# EAGLE design sc-001 (EAGLE 9.6.2)
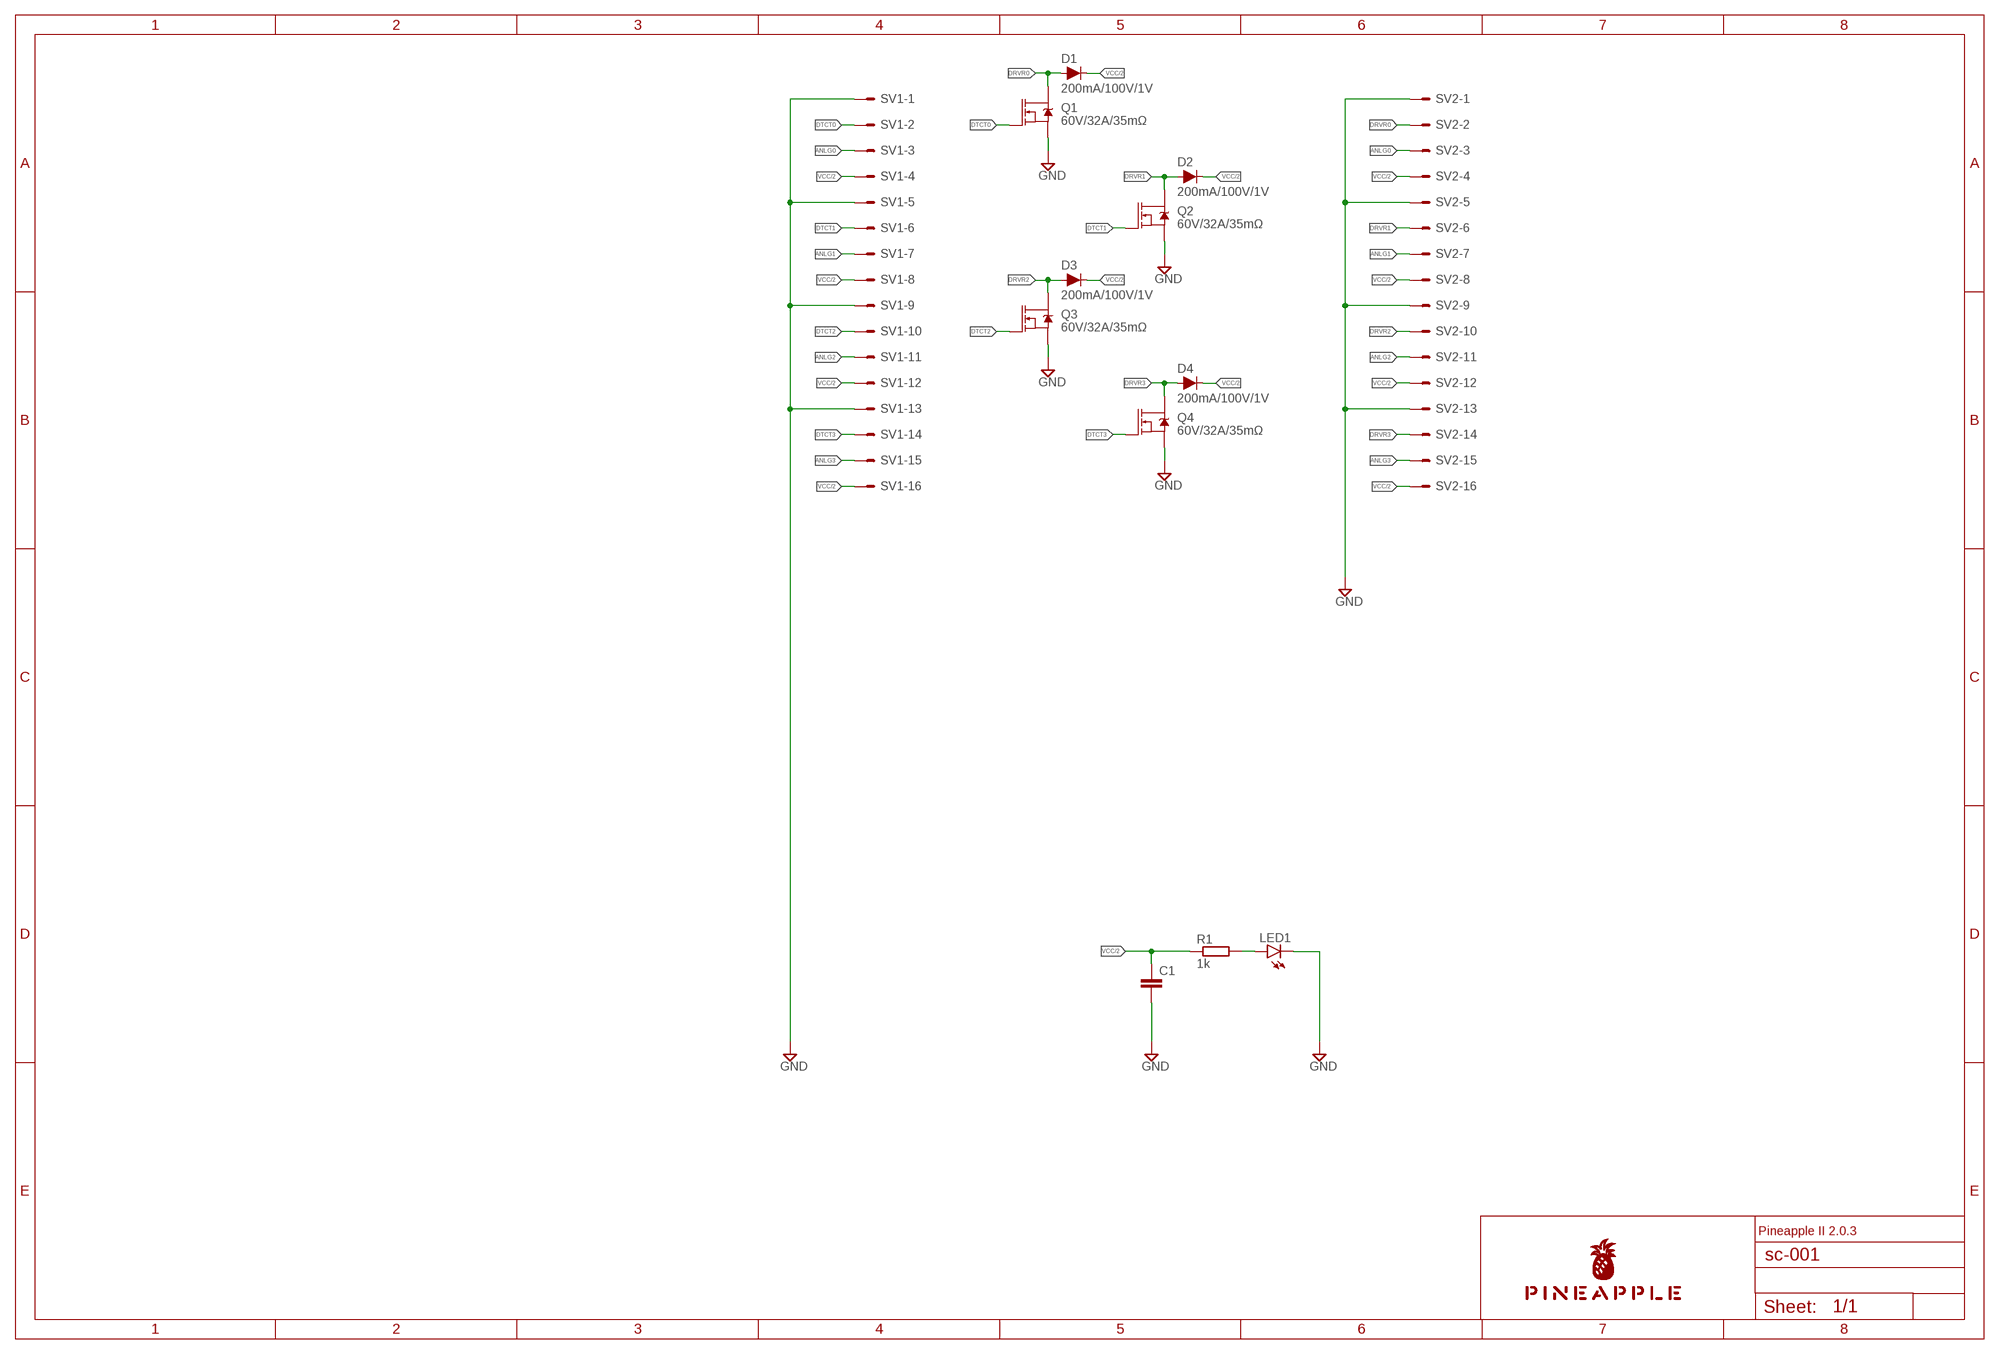
[diagram p0: schematic, sheet 1]

## Parts
C1  C-EU025-025X050  [C025-025X050]
D1  200mA/100V/1V  DIODE-1N4148  [DIODE-1N4148]
D2  200mA/100V/1V  DIODE-1N4148  [DIODE-1N4148]
D3  200mA/100V/1V  DIODE-1N4148  [DIODE-1N4148]
D4  200mA/100V/1V  DIODE-1N4148  [DIODE-1N4148]
LED1  LED3MM  [LED3MM]
Q1  60V/32A/35mΩ  MOSFET-NCH-FQP30N06L  [TO220V]
Q2  60V/32A/35mΩ  MOSFET-NCH-FQP30N06L  [TO220V]
Q3  60V/32A/35mΩ  MOSFET-NCH-FQP30N06L  [TO220V]
Q4  60V/32A/35mΩ  MOSFET-NCH-FQP30N06L  [TO220V]
R1  1k  R-EU_0204/5  [0204/5]
SV1  ML16LE  [ML16L]
SV2  ML16LE  [ML16L]
U$1  PINEAPPLE450_SILK  [PINEAPPLE450_SILK]

## Nets
ANLG0 [analog]: SV1.3 SV2.3
ANLG1 [analog]: SV1.7 SV2.7
ANLG2 [analog]: SV1.11 SV2.11
ANLG3 [analog]: SV1.15 SV2.15
DRVR0 [power]: D1.A Q1.2(D) SV2.2
DRVR1 [power]: D2.A Q2.2(D) SV2.6
DRVR2 [power]: D3.A Q3.2(D) SV2.10
DRVR3 [power]: D4.A Q4.2(D) SV2.14
DTCT0: Q1.1(G) SV1.2
DTCT1: Q2.1(G) SV1.6
DTCT2: Q3.1(G) SV1.10
DTCT3: Q4.1(G) SV1.14
GND [gnd]: C1.2 LED1.K(C) Q1.3(S) Q2.3(S) Q3.3(S) Q4.3(S) SV1.1 SV1.5 SV1.9 SV1.13 SV2.1 SV2.5 SV2.9 SV2.13
VCC2LED: LED1.A R1.2
VCC/2 [power]: C1.1 D1.C D2.C D3.C D4.C R1.1 SV1.4 SV1.8 SV1.12 SV1.16 SV2.4 SV2.8 SV2.12 SV2.16

## Notes on the sheet
- Pineapple II 2.0.3

## Library data of the parts
C1 = rcl:C-EU: CAPACITOR, European symbol; SPICEPREFIX: C
D1-D4 = SparkFun-DiscreteSemi:DIODE: Diode These are standard reverse protection diodes and small signal diodes. SparkFun Products: SparkFun SparkPunk Sound Kit <https://www.sparkfun.com/products/11177> SparkFun ESP8266 Thing <https://www.sparkfun.com/products/13231>; PROD_ID: DIO-08378
LED1 = led:LED: LED OSRAM: - CHIPLED LG R971, LG N971, LY N971, LG Q971, LY Q971, LO R971, LY R971 LH N974, LH R974 LS Q976, LO Q976, LY Q976 LO Q996 - Hyper CHIPLED LW Q18S LB Q993, LB Q99A, LB R99A - SideLED LS A670, LO A670, LY A670, LG A670, LP A670 LB A673, LV A673, LT A673, LW A673 LH A674 LY A675 LS A676, LA A676, LO A676, LY A676, LW A676 LS A679, LY A679, LG A679 - Hyper Micro SIDELED® LS Y876, LA Y876, LO Y876, LY Y876 LT Y87S - SmartLED LW L88C, LW L88S LB L89C, LB L89S, LG L890 LS L89K, LO L89K, LY L89K LS L896, LA L896, LO L896, LY L896 - TOPLED LS T670, LO T670, LY T670, LG T670, LP T670 LSG T670, LSP T670, LSY T670, LOP T670, LYG T670 LG T671, LOG T671, LSG T671 LB T673, LV T673, LT T673, LW T673 LH T674 LS T676, LA T676, LO T676, LY T676, LB T676, LH T676, LSB T676, LW T676 LB T67C, LV T67C, LT T67C, LS T67K, LO T67K, LY T67K, LW E67C LS E67B, LA E67B, LO E67B, LY E67B, LB E67C, LV E67C, LT E67C LW T67C LS T679, LY T679, LG T679 LS T770, LO T770, LY T770, LG T770, LP T770 LB T773, LV T773, LT T773, LW T773 LH T774 LS E675, LA E675, LY E675, LS T675 LS T776, LA T776, LO T776, LY T776, LB T776 LHGB T686 LT T68C, LB T68C - Hyper Mini TOPLED® LB M676 - Mini TOPLED Santana® LG M470 LS M47K, LO M47K, LY M47K Source: http://www.osram.convergy.de LUXEON: - LUMILED® LXK2-PW12-R00, LXK2-PW12-S00, LXK2-PW14-U00, LXK2-PW14-V00 LXK2-PM12-R00, LXK2-PM12-S00, LXK2-PM14-U00 LXK2-PE12-Q00, LXK2-PE12-R00, LXK2-PE12-S00, LXK2-PE14-T00, LXK2-PE14-U00 LXK2-PB12-K00, LXK2-PB12-L00, LXK2-PB12-M00, LXK2-PB14-N00, LXK2-PB14-P00, LXK2-PB14-Q00 LXK2-PR12-L00, LXK2-PR12-M00, LXK2-PR14-Q00, LXK2-PR14-R00 LXK2-PD12-Q00, LXK2-PD12-R00, LXK2-PD12-S00 LXK2-PH12-R00, LXK2-PH12-S00 LXK2-PL12-P00, LXK2-PL12-Q00, LXK2-PL12-R00 Source: www.luxeon.com KINGBRIGHT: KA-3528ASYC Source: www.kingbright.com
Q1-Q4 = SparkFun-DiscreteSemi:MOSFET-NCH: N-channel MOSFETs Voltage controlled devices that allow control of high current outputs. SparkFun Products: SparkFun OpenScale <https://www.sparkfun.com/products/13261> SparkFun Digital Sandbox <https://www.sparkfun.com/products/12651> SparkFun Monster Moto Shield <https://www.sparkfun.com/products/10182> SparkFun MOSFET Power Controller <https://www.sparkfun.com/products/11214>; PROD_ID: TRANS-10060
R1 = rcl:R-EU_: RESISTOR, European symbol; SPICEPREFIX: R
SV1 SV2 = con-ml:ML16LE: HARTING; OC_FARNELL: unknown; OC_NEWARK: unknown
U$1 = pineapple:PINEAPPLE450_SILK

## Net classes
0 default: width 0.152 mm, drill 0.152 mm, clearance 0.152 mm
1 gnd: width 0.305 mm, drill 0.152 mm, clearance 0.152 mm
2 power: width 0.508 mm, drill 0.152 mm, clearance 0.152 mm
3 analog: width 0.305 mm, drill 0.152 mm, clearance 0.152 mm
4 superpower: width 1.016 mm, drill 0.152 mm, clearance 0.152 mm

## Board
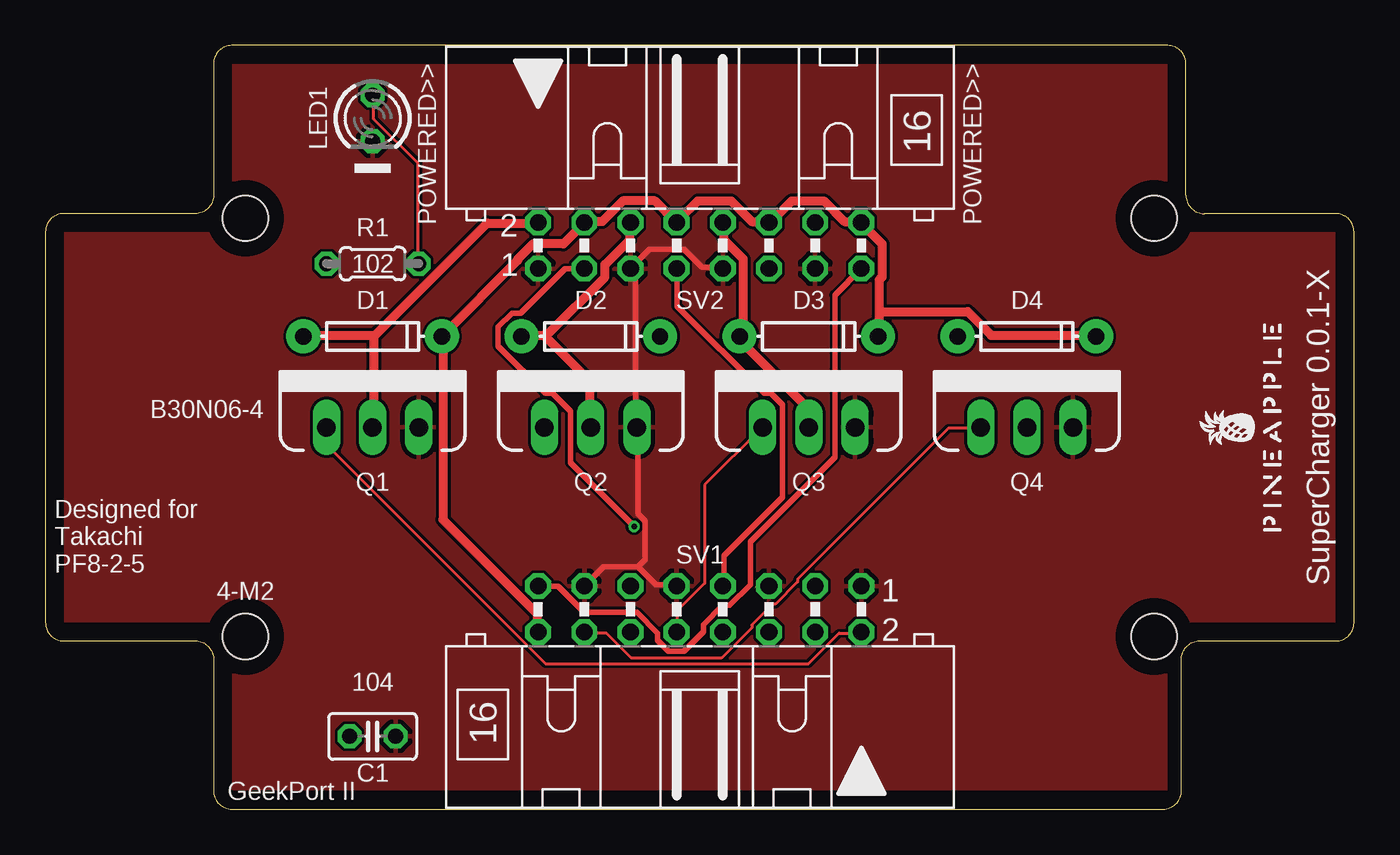
[diagram p1: board, top side]
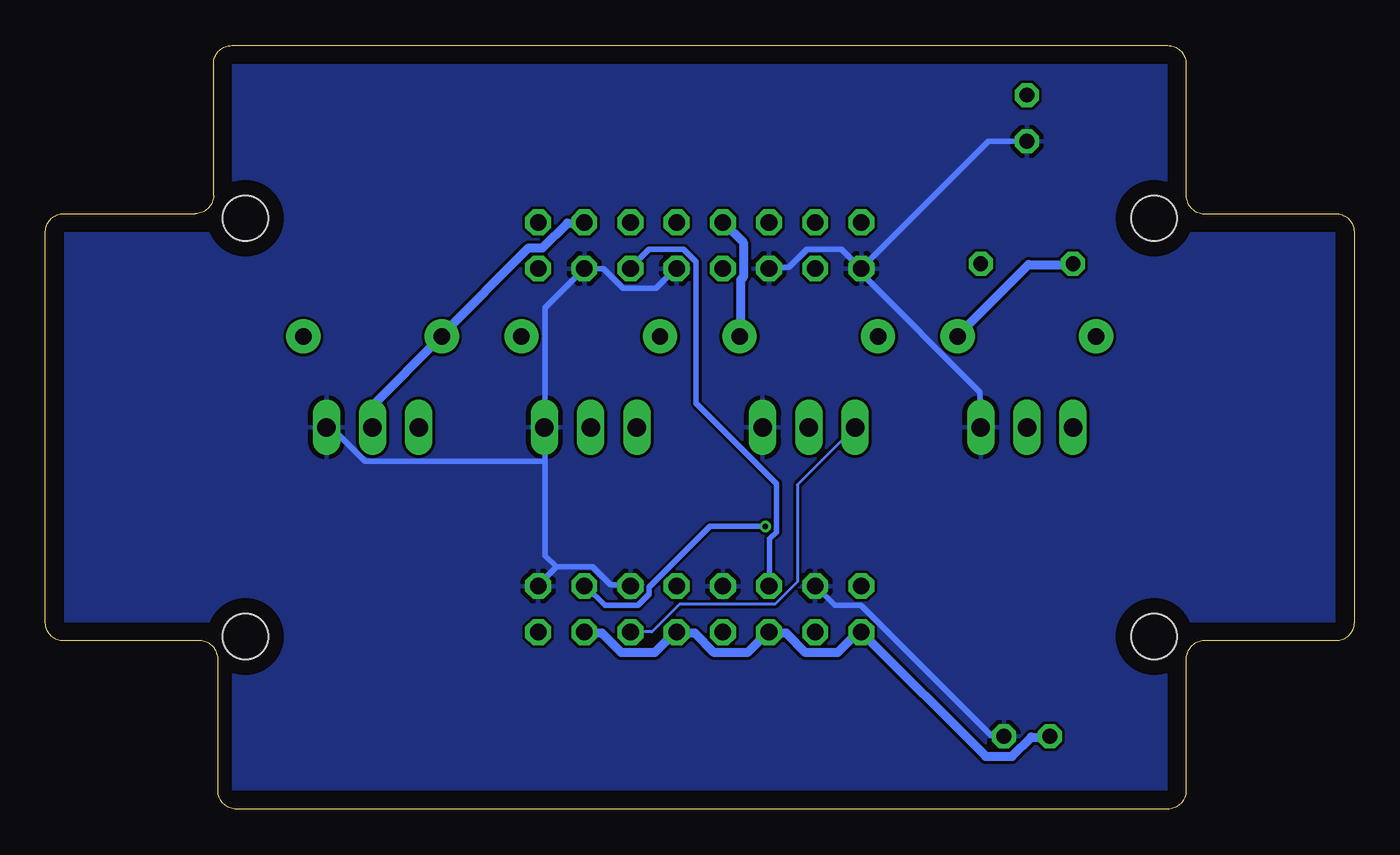
[diagram p2: board, bottom side, seen from below]

Size 72 x 42 mm. Coordinates in mm from the lower left corner, seen from the top.
Outline: 61.75,42 10.25,42 arc90 9.25,41 9.25,33.75 arc-90 8.25,32.75 1,32.75 arc90 0,31.75 0,10.25 arc90 1,9.25 8.25,9.25 arc-90 9.25,8.25 9.25,1 arc90 10.25,0 61.5,0 arc90 62.5,1 62.5,8.25 arc-90 63.5,9.25 71,9.25 arc90 72,10.25 72,31.75 arc90 71,32.75 63.75,32.75 arc-90 62.75,33.75 62.75,41 arc90 61.75,42
Copper layers (1*16): Top 0.035mm / dielectric 1.5mm / Bottom 0.035mm
Design rules "SeeedStudio_2layer_DRU_no_angle_20140221": minimum track width 6mil, minimum drill 12mil, track to track 6mil, track to pad 6mil, pad to pad 6mil, via to via 6mil, smd to smd 0mil, copper to edge 10mil, drill to drill 10mil, minimum pad ring 10mil, minimum via ring 6mil, stop-mask expansion 2mil, vias tented up to drill 100mil, thermal gap 10mil
Holes 2.5 mm at 61,32.5 11,32.5 11,9.5 61,9.5
tRestrict: area 9,30.5 to 13,34.5; area 59,30.5 to 63,34.5; area 9,7.5 to 13,11.5; area 59,7.5 to 63,11.5; area 0,41 to 72,42; area 71,0 to 72,42; area 0,0 to 72,1; area 0,0 to 1,42; area 0,31.8 to 9.2,32.8; area 9.2,32.8 to 10.2,42; area 61.8,32.8 to 62.8,42; area 62.8,31.8 to 72,32.8; 4 more areas
bRestrict: area 9,7.5 to 13,11.5; area 59,7.5 to 63,11.5; area 59,30.5 to 63,34.5; area 9,30.5 to 13,34.5; area 61.8,0 to 62.8,9.2; area 62.8,9.2 to 72,10.2; area 71,0 to 72,42; area 62.8,31.8 to 72,32.8; area 61.8,32.8 to 62.8,42; area 0,41 to 72,42; area 9.2,32.8 to 10.2,42; area 0,31.8 to 9.2,32.8; 4 more areas

### Footprints (pad centres in the part's own frame; a part is rotated, then mirrored left to right if it is on the bottom)
C025-025X050 = drill 0.813 octagon: 1 -1.27,0; 2 1.27,0
DIODE-1N4148 = drill 0.9 pad 1.88: A -3.81,0; C 3.81,0
LED3MM = drill 0.813 octagon: A -1.27,0; K 1.27,0
TO220V = drill 1.016 long: 1 -2.54,0; 2 0,0; 3 2.54,0
0204/5 = drill 0.813 octagon: 1 -2.54,0; 2 2.54,0
ML16L = drill 0.914 octagon: 1 -8.89,-1.27; 2 -8.89,1.27; 3 -6.35,-1.27; 4 -6.35,1.27; 5 -3.81,-1.27; 6 -3.81,1.27; 7 -1.27,-1.27; 8 -1.27,1.27; 9 1.27,-1.27; 10 1.27,1.27; 11 3.81,-1.27; 12 3.81,1.27; 13 6.35,-1.27; 14 6.35,1.27; 15 8.89,-1.27; 16 8.89,1.27

### Placement (x,y rotation side)
C1  18,4 0 top
D1  18,26 0 top
D2  30,26 0 top
D3  42,26 0 top
D4  54,26 0 top
LED1  18,38 270 top
Q1  18,21 0 top
Q2  30,21 0 top
Q3  42,21 0 top
Q4  54,21 0 top
R1  18,30 0 top
SV1  36,11 180 top
SV2  36,31 0 top
U$1  68,21 90 top

### Tracks (layer width: path | path; a pad name or v marks a point on that pad's centre or on a via)
ANLG0  (via drill 0.3)
  Top 0.305: v32.38,15.54 28.88,19.05 28.88,21.87 27.89,22.86 27.51,22.86 24.92,25.45 24.92,26.52 25.68,27.28 26.14,27.28 28.57,29.72 29.64,29.72 SV2.3
  Bottom 0.305: v32.38,15.54 35.43,15.54 38.79,12.19 38.79,11.81 39.4,11.2 41.22,11.2 42.29,12.27 SV1.3
ANLG1
  Top 0.305: SV2.7 34.75,29.72 34.75,27.66 39.55,22.86 39.93,22.86 40.54,22.25 40.54,17.14 37.34,13.95 37.34,12.34 SV1.7
ANLG2
  Bottom 0.305: SV1.11 32.16,12.34 32.16,14.86 31.77,15.24 31.77,17.91 36.2,22.33 36.2,30.1 36.88,30.79 38.79,30.79 39.78,29.79 SV2.11
ANLG3
  Top 0.305: SV1.15 27.13,12.27 28.19,12.27 29.64,10.82 32.54,10.82 33.68,9.68 33.68,9.3 34.29,8.69 35.13,8.69 36.2,9.75 36.2,10.13 37.26,11.2 37.64,11.2 38.79,12.34 38.79,14.71 43.43,19.36 43.43,28.27 44.88,29.72 SV2.15
DRVR0
  Top 0.508: 18.14,26.06 24.31,32.23 27.05,32.23 SV2.2 | 18.14,26.06 14.25,26.06 D1.A | Q1.2 18.06,21.03 18.06,25.83 18.14,26.06
DRVR1
  Top 0.508: 27.58,26.06 30.79,29.26 30.79,29.95 32.16,31.32 32.16,32.23 SV2.6 | 27.58,26.06 26.21,26.06 D2.A | Q2.2 29.95,21.03 29.95,23.55 27.66,25.83 27.58,26.06
DRVR2
  Top 0.508: SV2.10 37.34,32.23 37.34,31.32 38.41,30.25 38.41,26.21 38.25,26.06 D3.A 38.25,25.76 41.99,22.02 41.99,21.03 Q3.2
DRVR3
  Bottom 0.508: SV2.14 42.37,32.23 43.28,32.23 44.65,30.86 45.41,30.86 50.22,26.06 D4.A 50.37,25.83 53.95,22.25 53.95,21.03 Q4.2
DTCT0
  Top 0.152: SV1.2 44.88,9.68 43.66,9.68 41.99,8 27.51,8 15.47,20.04 15.47,20.95 Q1.1
DTCT1
  Bottom 0.152: SV1.6 39.78,9.75 38.63,9.75 37.11,11.28 31.85,11.28 30.63,12.5 30.63,17.83 27.51,20.95 Q2.1
DTCT2
  Top 0.152: SV1.10 34.75,9.75 34.75,10.9 36.27,12.42 36.27,17.83 39.4,20.95 Q3.1
DTCT3
  Top 0.152: SV1.14 29.72,9.68 30.86,9.68 32.23,8.31 37.19,8.31 38.86,9.98 38.86,10.13 40.01,11.28 40.16,11.28 41.38,12.5 41.38,12.65 49.68,20.95 51.44,20.95 Q4.1
GND
  Top 0.305: 32.61,13.34 33.6,12.34 34.67,12.34 SV1.9 | 32.61,13.34 30.71,13.34 29.72,12.34 SV1.13 | 32.61,13.34 32.99,13.72 32.99,15.85 32.61,16.23 32.61,20.95 Q2.3 32.46,21.11 32.46,29.49 32.31,29.64 SV2.5 32.23,29.79 33.22,30.79 35.13,30.79 36.12,29.79 37.26,29.79 SV2.9
  Bottom 0.305: C1.2 19.28,4.04 19.96,4.04 27.13,11.2 28.57,11.2 SV1.13 | 43.89,13.34 41.91,13.34 40.92,12.34 39.85,12.34 SV1.5 | 43.89,13.34 44.88,12.34 SV1.1 | 44.5,19.13 44.5,13.95 43.89,13.34 | 44.5,19.13 44.5,20.95 Q3.3 44.5,21.11 44.5,27.58 42.44,29.64 SV2.13 42.29,29.72 41.3,29.72 40.23,28.65 38.41,28.65 37.34,29.72 SV2.9 | 44.5,19.13 54.41,19.13 56.24,20.95 56.46,20.95 Q4.3 | LED1.K 18.06,36.73 20.12,36.73 27.05,29.79 SV2.1 | SV2.5 32.16,29.79 31.09,29.79 30.1,30.79 28.19,30.79 27.2,29.79 SV2.1 | Q1.3 20.57,21.03 20.57,22.94 27.05,29.41 27.05,29.64 SV2.1
  pour Top: -1,-1 73,-1 73,43 -1,43
  pour Bottom: -2,-2 74,-2 74,44 -2,44
VCC2LED
  Top 0.152: LED1.A 18.06,39.24 18.06,37.95 20.5,35.51 20.5,30.02 R1.2
VCC/2
  Top 0.508: 45.87,27.36 45.87,29.11 46.02,29.26 46.02,31.09 45.03,32.08 SV2.16 44.88,32.31 43.97,32.31 42.82,33.45 41.07,33.45 40.01,32.38 SV2.12 39.78,32.31 38.86,32.31 37.72,33.45 35.89,33.45 34.9,32.46 SV2.8 34.67,32.31 33.53,33.45 31.77,33.45 30.63,32.31 29.72,32.31 SV2.4 29.49,32.08 28.5,31.09 26.82,31.09 25.98,30.25 25.98,30.18 21.87,26.06 D1.C 21.87,25.76 21.87,15.93 27.05,10.74 27.05,9.75 SV1.16 | 45.87,27.36 45.87,26.06 D3.C | 45.87,27.36 50.75,27.36 52.05,26.06 57.76,26.06 D4.C
  Bottom 0.508: C1.1 16.76,3.96 17.75,3.96 18.82,2.9 20.27,2.9 27.05,9.68 SV1.16 27.36,9.68 28.42,8.61 30.18,8.61 31.24,9.68 32.16,9.68 SV1.12 32.38,9.6 33.38,8.61 35.2,8.61 36.27,9.68 37.26,9.68 SV1.8 37.49,9.6 38.48,8.61 40.31,8.61 41.38,9.68 42.29,9.68 SV1.4 | R1.1 15.47,29.95 17.91,29.95 21.79,26.06 D1.C | D2.C 33.76,26.06 33.76,29.11 33.6,29.26 33.6,31.17 34.67,32.23 SV2.8

### Text on the board
tNames: POWERED>> | POWERED>> | 102 | B30N06-4 | SuperCharger 0.0.1-X | Designed for / Takachi / PF8-2-5 | 4-M2 | 104 | GeekPort II